# Altium schematic sheet 02_Power_Budget.SchDoc
size A4; SheetNumber: 3; SheetTotal: 6
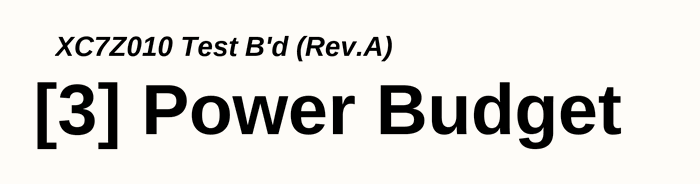
[diagram p0: 02_Power_Budget.SchDoc]

## Notes on the sheet
- XC7Z010 Test B'd (Rev.A)
- [3] Power Budget